# Altium schematic sheet Digital.SchDoc
size 494 x 320 mm
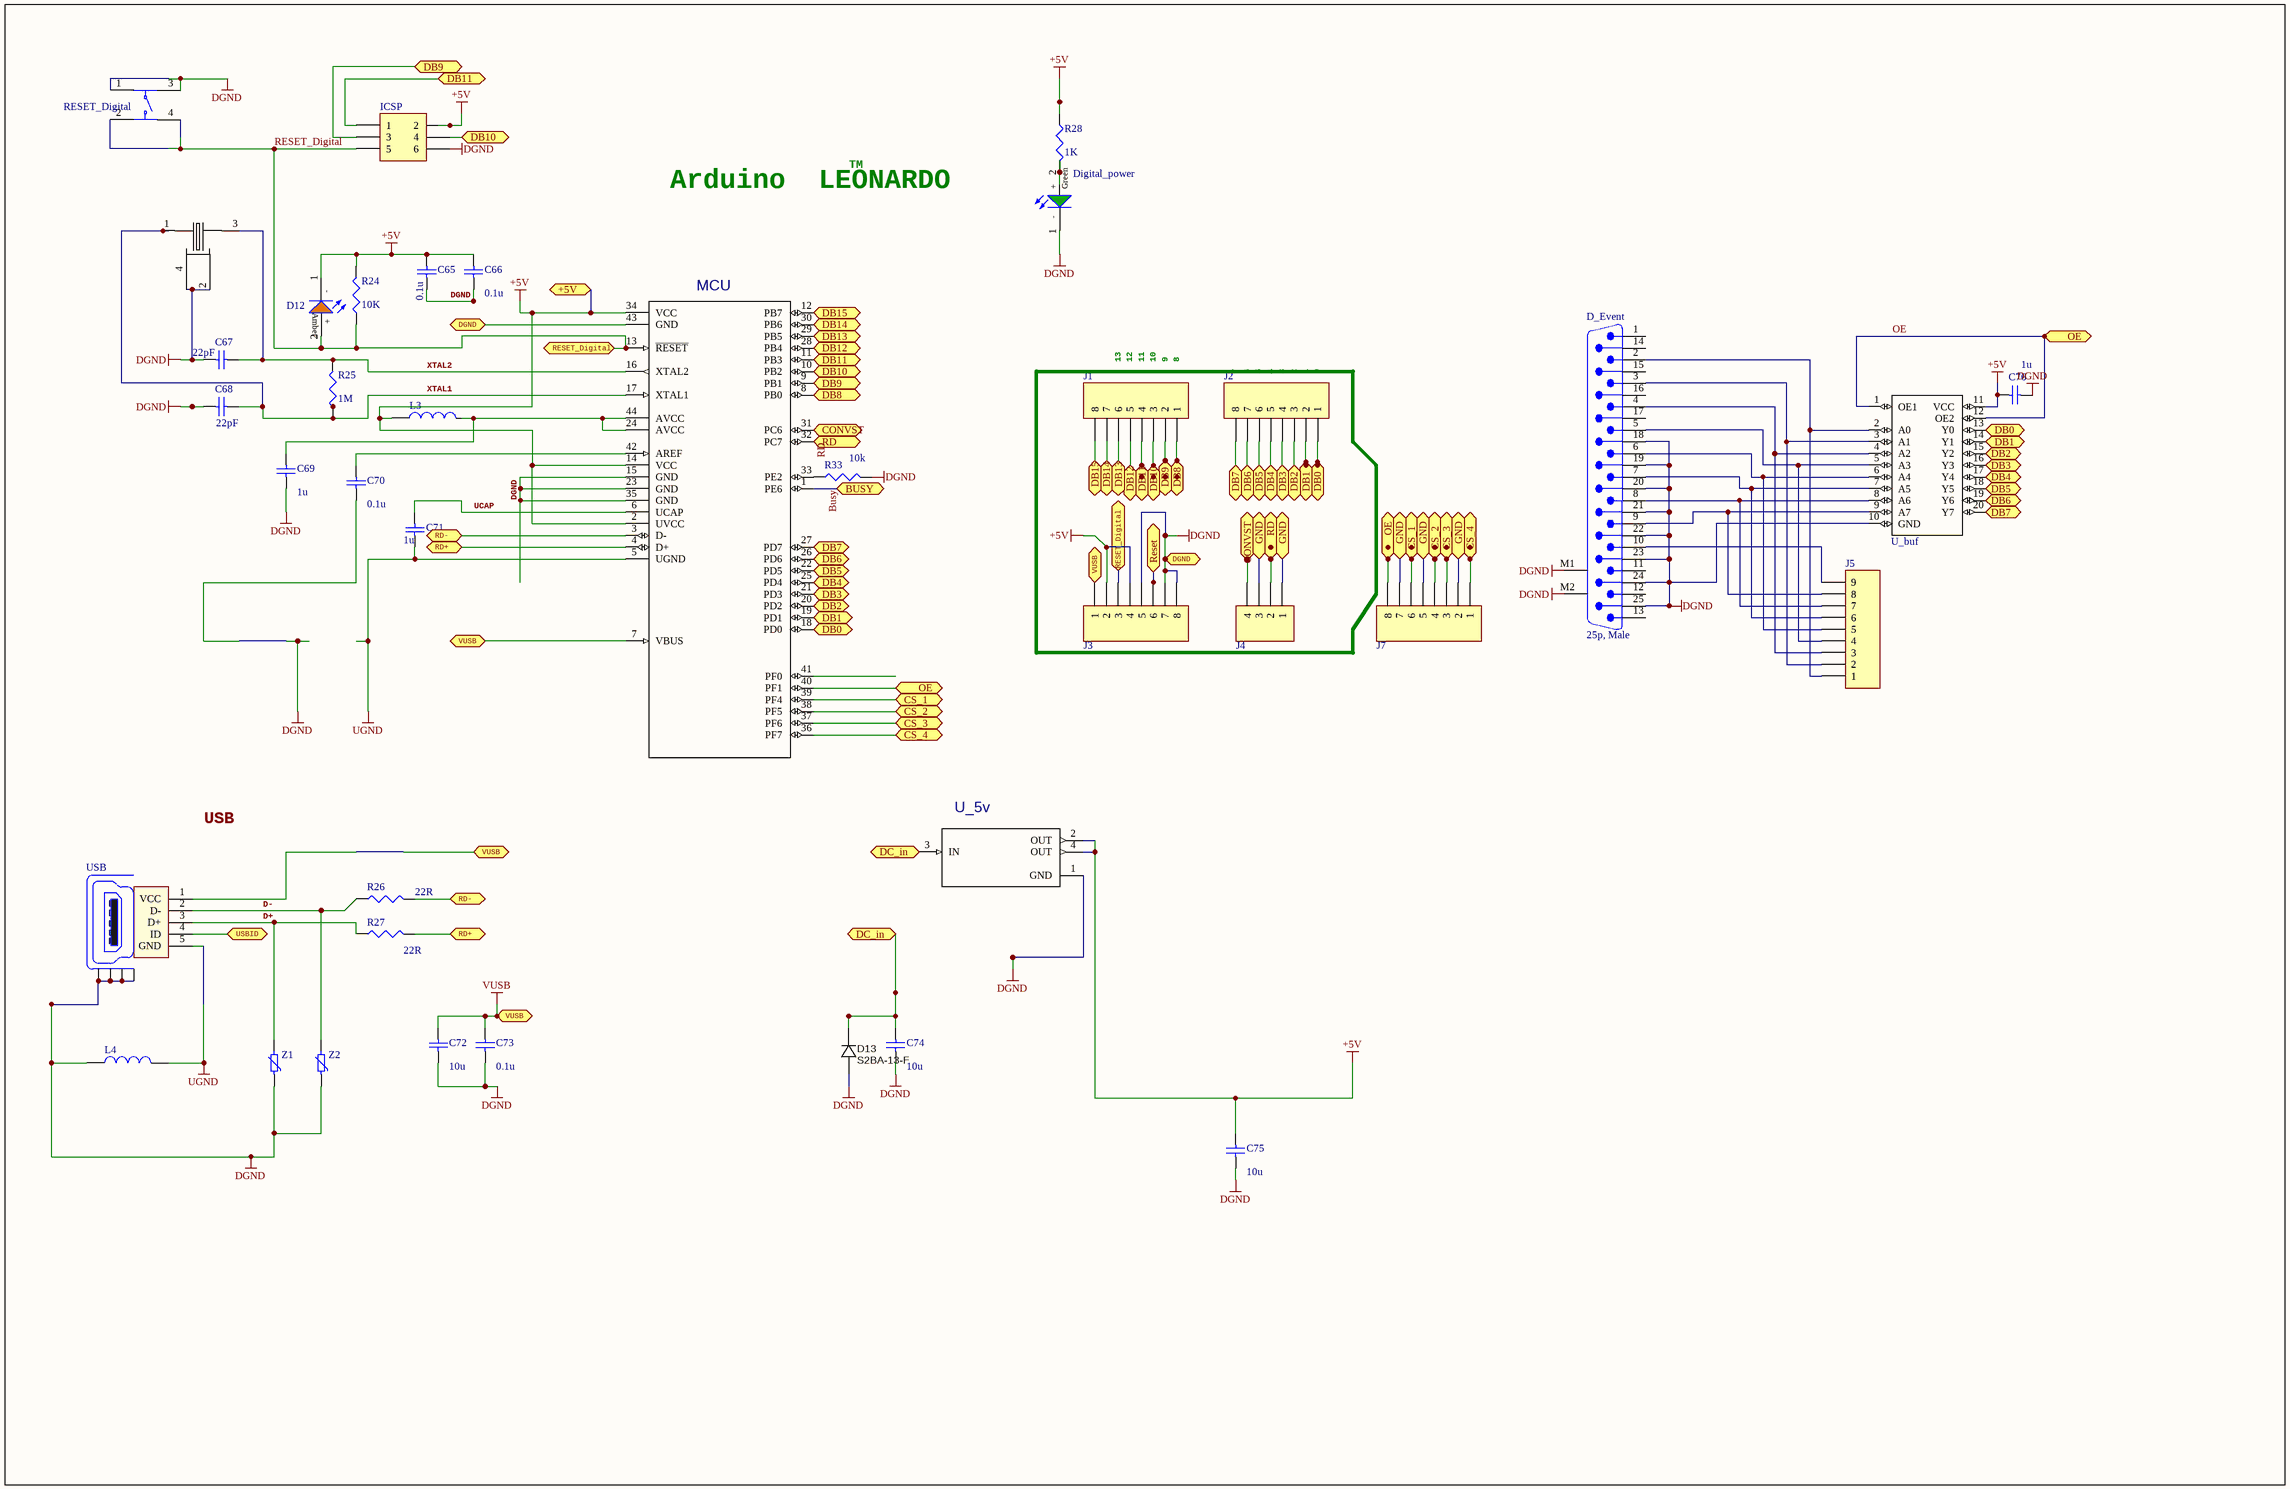
[diagram p0: Digital.SchDoc]

## Parts
C65  value 0.1u  [0603]
C66  value 0.1u  [0603]
C67  value 22pF  [0603]
C68  value 22pF  [0603]
C69  value 1u  [0805]
C70  value 0.1u  [0603]
C71  value 1u  [0805]
C72  value 10u  [0805]
C73  value 0.1u  [0603]
C74  value 10u  [0805]
C75  value 10u  [0805]
C76  value 1u  [0805]
D12  150120AS75000  [WL-SMCW_1206]  (value not drawn)
D13  Manufacturer Part Number 1: S2BA-13-F  [DO-214AC]  (hidden comment: 100V; 1.5A)
D_Event  25p, Male  [618025233721]
Digital_power  150080GS75000  [WL-SMCW_0805]  (value not drawn)
ICSP  (no value)  [HDR2X3]
J1  (no value)  [HDR1X8]
J2  (no value)  [HDR1X8]
J3  (no value)  [HDR1X8]
J4  (no value)  [HDR1X4]
J5  (no value)  [HDR1X9]
J7  (no value)  [HDR1X8]
L3  (no value)  [WE-CBF_0805_High Speed]
L4  (no value)  [WE-CBF_0805_High Speed]
MCU  ATMEGA32U4-AU  [QFP80P1200X1200X120-44N]  (value not drawn)
R24  value 10K  [J1-0603]
R25  value 1M  [J1-0603]
R26  value 22R  [J1-0603]
R27  value 22R  [J1-0603]
R28  value 1K  [J1-0603]
R33  value 10k  [J1-0603]
RESET_Digital  430152043826  [4301x20438x6]  (value not drawn)
U_5v  NCP1117ST50T3G  [SOT230P700X180-4N]  (value not drawn)
U_buf  74HC541  [TSSOP20]  (value not drawn)
USB  651005136521  [651005136521]  (value not drawn)
Y1  ABM3B-24.000MHZ-B2-T  [OSCSC500X320X110-4N]  (value not drawn)
Z1  14 Vrms , 18 Vdc  [WE-VS_0603]  (value not drawn)
Z2  14 Vrms , 18 Vdc  [WE-VS_0603]  (value not drawn)

## Ports
+5V, BUSY, CONVST, CS_1, CS_2, CS_3, CS_4, DB0, DB1, DB2, DB3, DB4, DB5, DB6, DB7, DB8, DB9, DB10, DB11, DB12, DB13, DB14, DB15, DC_in, DGND, GND, OE, RD, RD+, RD-, Reset, RESET_Digital, USBID, VUSB

## Nets
+5V: C65.2 C66.2 C75.1 C76.2 D12.1(-) ICSP.2 J3.2 J3.4 L3.1 MCU.2(UVCC) MCU.14(VCC) MCU.34(VCC) R24.2 R28.1 U_5v.2(OUT) U_5v.4(OUT) U_buf.11(VCC) ; port +5V
DGND: C65.1 C66.1 C67.2 C68.2 C69.1 C70.2 C72.1 C73.1 C74.2 C75.2 C76.1 D13.A D_Event.18 D_Event.19 D_Event.20 D_Event.21 D_Event.22 D_Event.23 D_Event.24 D_Event.25 D_Event.M1 D_Event.M2 Digital_power.1(-) ICSP.6 J3.5 J3.7 J3.8 L4.1 MCU.15(GND) MCU.23(GND) MCU.35(GND) MCU.43(GND) R33.1 RESET_Digital.1 RESET_Digital.3 U_5v.1(GND) U_buf.10(GND) USB.Z1(Shield) USB.Z2(Shield) USB.Z3(Shield) USB.Z4(Shield) Y1.2 Y1.4 Z1.1(I/O1) Z2.1(I/O1) ; port DGND
UGND: C71.1 L4.2 MCU.5(UGND) USB.5(GND)
VUSB: C72.2 C73.2 J3.1 MCU.7(VBUS) USB.1(VCC) ; port VUSB
Busy: MCU.1(PE6) ; port BUSY
CONVST: J4.4 MCU.31(PC6) ; port CONVST
CS_1: J7.6 MCU.39(PF4) ; port CS_1
CS_2: J7.4 MCU.38(PF5) ; port CS_2
CS_3: J7.3 MCU.37(PF6) ; port CS_3
CS_4: J7.1 MCU.36(PF7) ; port CS_4
D+: R27.2 USB.3(D+) Z1.2(I/O1)
D-: R26.2 USB.2(D-) Z2.2(I/O1)
DB0: J2.1 MCU.18(PD0) U_buf.13(Y0) ; port DB0
DB1: J2.2 MCU.19(PD1) U_buf.14(Y1) ; port DB1
DB2: J2.3 MCU.20(PD2) U_buf.15(Y2) ; port DB2
DB3: J2.4 MCU.21(PD3) U_buf.16(Y3) ; port DB3
DB4: J2.5 MCU.25(PD4) U_buf.17(Y4) ; port DB4
DB5: J2.6 MCU.22(PD5) U_buf.18(Y5) ; port DB5
DB6: J2.7 MCU.26(PD6) U_buf.19(Y6) ; port DB6
DB7: J2.8 MCU.27(PD7) U_buf.20(Y7) ; port DB7
DB8: J1.1 MCU.8(PB0) ; port DB8
DB9: ICSP.3 J1.2 MCU.9(PB1) ; port DB9
DB10: ICSP.4 J1.3 MCU.10(PB2) ; port DB10
DB11: ICSP.1 J1.4 MCU.11(PB3) ; port DB11
DB12: J1.5 MCU.28(PB4) ; port DB12
DB13: J1.6 MCU.29(PB5) ; port DB13
DB14: J1.7 MCU.30(PB6) ; port DB14
DB15: J1.8 MCU.12(PB7) ; port DB15
DC_in: C74.1 D13.K U_5v.3(IN) ; port DC_in
GND: J4.1 J4.3 J7.2 J7.5 J7.7 ; port GND
OE: J7.8 MCU.40(PF1) U_buf.1(OE1) U_buf.12(OE2) ; port OE
RD: J4.2 MCU.32(PC7) ; port RD
RD+: MCU.4(D+) R27.1 ; port RD+
RD-: MCU.3(D-) R26.1 ; port RD-
Reset: J3.6 ; port Reset
RESET_Digital: D12.2(+) ICSP.5 J3.3 MCU.13(~{RESET}) R24.1 RESET_Digital.2 RESET_Digital.4 ; port RESET_Digital
UCAP: C71.2 MCU.6(UCAP)
USBID: USB.4(ID) ; port USBID
XTAL1: C68.1 MCU.17(XTAL1) R25.1 Y1.1
XTAL2: C67.1 MCU.16(XTAL2) R25.2 Y1.3
NetC69_2: C69.2 L3.2 MCU.24(AVCC) MCU.44(AVCC)
NetC70_1: C70.1 MCU.42(AREF)
NetD_Event_2: D_Event.2 J5.1 U_buf.2(A0)
NetD_Event_3: D_Event.3 J5.2 U_buf.3(A1)
NetD_Event_4: D_Event.4 J5.3 U_buf.4(A2)
NetD_Event_5: D_Event.5 J5.4 U_buf.5(A3)
NetD_Event_6: D_Event.6 J5.5 U_buf.6(A4)
NetD_Event_7: D_Event.7 J5.6 U_buf.7(A5)
NetD_Event_8: D_Event.8 J5.7 U_buf.8(A6)
NetD_Event_9: D_Event.9 J5.8 U_buf.9(A7)
NetD_Event_10: D_Event.10 J5.9
NetDigital_power_2: Digital_power.2(+) R28.2
NetMCU_33: MCU.33(PE2) R33.2

Not connected (* = marked no-connect by the designer): D_Event 1 11 12 13 14 15 16 17; MCU 41(PF0)

## Notes on the sheet
- Arduino  LEONARDO
- TM
- 13
- 12
- 11
- 10
- 9
- 8
- (near J2) 7
- (near J2) 6
- (near J2) 5
- (near J2) 4
- (near J2) 3
- (near J2) 2
- (near J2) 1
- (near J2) 0
- USB
- (in symbol WL-SMCW 0805, 150080GS75000) Green
- (in symbol WL-SMCW 1206, 150120AS75000) Amber

## Library data of the parts
C65-C68 C70 C73 = C0603: Ceramic Chip Capacitor - Standard; Note: Footprint corresponds to dimensions for bulk cassette packaging. This case size has tightened tolerances.; Published: 17-Jul-2002; LatestRevisionDate: 19-Mar-2004; LatestRevisionNote: Silkscreen size reduced.; DatasheetDocument: Mar-2001; PackageDocument: Mar-2001; PackageReference: 0603; Publisher: Altium Limited; Code_JEITA: 0603; Code_IPC: 1608 [0603]; ComponentLink1Description: Manufacturer Link; ComponentLink1URL: http://www.kemet.com/; ComponentLink2Description: Datasheet; ComponentLink2URL: http://www.kemet.com/kemet/web/homepage/kechome.nsf/vapubfilesname/F3102TA.pdf/$file/F3102TA.pdf
C69 C71 C72 C74-C76 = C0805: Ceramic Chip Capacitor - Standard; Note: Footprint corresponds to dimensions for bulk cassette packaging. This case size has tightened tolerances.; Published: 17-Jul-2002; LatestRevisionDate: 19-Mar-2004; LatestRevisionNote: Silkscreen size reduced.; DatasheetDocument: Mar-2001; PackageDocument: Mar-2001; PackageReference: 0805; Publisher: Altium Limited; Code_JEITA: 0805; Code_IPC: 2012[0805]; ComponentLink1Description: Manufacturer Link; ComponentLink1URL: http://www.kemet.com/; ComponentLink2Description: Datasheet; ComponentLink2URL: http://www.kemet.com/kemet/web/homepage/kechome.nsf/vapubfilesname/F3102TA.pdf/$file/F3102TA.pdf
D12 = WL-SMCW 1206, 150120AS75000: WL-SMCW SMD chip LED top view mono-color waterclear, 1206, Amber; Manufacturer: Wurth Elektronik; PartNo: 150120AS75000; ComponentLink1Description: Manufacturer; ComponentLink1URL: http://www.we-online.de; Created by: Baojun Chen; Created Date: March 2016; ComponentLink2Description: Datasheet; ComponentLink2URL: http://katalog.we-online.de/led/datasheet/150120AS75000.pdf
D13 = DIODE_100V_1.5A_SMA: Diode SMD 100V 1.5A SMA; Manufacturer 1: Diodes Inc; Material: Si; Diode Type: Standard; Value: Vf = 1.15V @ 1.5A (Max); SCDType: source; Package / Case: DO-214AC, SMA; Ratings: 100V; 1.5A; Supplier 1: Digi-Key; Supplier Part Number 1: S2BA-FDICT-ND
D_Event = 618025233721: WR-DSUB 10.30mm Male Angled PCB Connector without Hex Screw, 25p; PinNumber: 25; ComponentLink1URL: http://www.we-online.de; ComponentLink2URL: http://katalog.we-online.de/em/datasheet/6180xx233721.pdf; Published: June 2016; Publisher: Wurth Elektronik; ComponentLink1Description: Manufacturer; ComponentLink2Description: Datasheet; PartNumber: 618025233721
Digital_power = WL-SMCW 0805, 150080GS75000: WL-SMCW SMD chip LED top view mono-color waterclear, 0805, Green; Manufacturer: Wurth Elektronik; PartNo: 150080GS75000; ComponentLink1Description: Manufacturer; ComponentLink1URL: http://www.we-online.de; Created by: Baojun Chen; Created Date: March 2016; ComponentLink2Description: Datasheet; ComponentLink2URL: http://katalog.we-online.de/led/datasheet/150080GS75000.pdf
ICSP = Header 3X2: Header, 3-Pin, Dual row; LatestRevisionDate: 17-Jul-2002; LatestRevisionNote: Re-released for DXP Platform.; Publisher: Altium Limited
J1-J3 J7 = Header 8: Header, 8-Pin; LatestRevisionDate: 17-Jul-2002; LatestRevisionNote: Re-released for DXP Platform.; Publisher: Altium Limited
J4 = Header 4: Header, 4-Pin; LatestRevisionDate: 17-Jul-2002; LatestRevisionNote: Re-released for DXP Platform.; Publisher: Altium Limited
J5 = Header 9: Header, 9-Pin; LatestRevisionDate: 17-Jul-2002; LatestRevisionNote: Re-released for DXP Platform.; Publisher: Altium Limited
L3 L4 = WE-CBF, 7427920: WE-CBF SMD EMI Suppression Ferrite Bead, 0805, 11Ω; Type: High Speed; PublishedDate: Aug 2016; Publisher: Wurth Elektronik; ComponentLink1Description: Manufacturer; ComponentLink1URL: http://www.we-online.de; ComponentLink2Description: Datasheet; ComponentLink2URL: http://katalog.we-online.de/pbs/datasheet/7427920.pdf; PartNumber: 7427920; Value: 11Ω; Size: 0805
MCU = ATMEGA32U4-AU: ATmega Series 16 MHz 32 KB Flash 2.5 KB SRAM 8-Bit Microcontroller - TQFP-44; MF: Atmel; Price: 4.16 USD; Package: TQFP-44 Atmel; Availability: Good; MP: ATMEGA32U4-AU; Value: *
R24-R28 R33 = Res3: Resistor; Published: 8-Jun-2000; LatestRevisionDate: 29-May-2009; LatestRevisionNote: IPC-7351 Footprint Added.; PackageReference: J1-0603; Publisher: Altium Limited; PackageDescription: Chip Resistor
RESET_Digital = WS-TASV, 430152043826: WS-TASV 6x6 mm SMD; Manufacturer: Wurth Elektronik; partNo: 430152043826; ComponentLink1Description: Manufacturer; ComponentLink1URL: http://www.we-online.de; Created by: Baojun Chen; Created Date: Dec.2015; ComponentLink2Description: Datasheet; ComponentLink2URL: http://katalog.we-online.de/em/datasheet/4301x2xxx8x6.pdf
U_5v = NCP1117ST50T3G: 1.0 A Positive LDO Linear Voltage Regulator (Fixed and Adjustable) Vout: 5.0 V; MF: ON Semiconductor; Package: SOT-223-3 ON Semiconductor; MP: NCP1117ST50T3G; Price: 0.23 USD; Availability: Good; Value: *
U_buf = 74HC541: Tri-St.%20Oct%20Buffer%20DIP20; MF: Texas Instruments; Price: None; MP: 74HC541; Package: DIP-20 Texas Instruments; Availability: Unavailable; Value: *
USB = 651005136521: WR-COM Mini USB Horizontal TH Type B 5 Contacts; Manufacturer: Würth Elektronik eiSos GmbH; ComponentLink1 Description: Manufacturer; ComponentLink2 Description: Datasheet; NoPins: 5; ComponentLink1URL: http://www.we-online.de; ComponentLink2URL: http://katalog.we-online.de/em/datasheet/651005136521.pdf; Created by: Karrer Zheng; Created Date: 10/10/2014; partNo: 651005136521
Y1 = ABM3B-24.000MHZ-B2-T: Crystal 24MHz أ‚آ±20ppm (Tol) أ‚آ±50ppm (Stability) 18pF FUND 50Ohm 4-Pin CSMD T/R; MF: Abracon; Availability: Good; MP: ABM3B-24.000MHZ-B2-T; Package: 5.0 x 3.2mm Abracon; Price: 0.65 USD; Value: *
Z1 Z2 = 82556140: WE-VS SMD Varistor, size 0603, 14 Vrms , 18 Vdc; PublishedDate: Nov. 2016; Publisher: Wurth Elektronik; ComponentLink1Description: Manufacturer; ComponentLink1URL: http://www.we-online.de; ComponentLink2Description: Datasheet; ComponentLink2URL: http://katalog.we-online.de/pbs/datasheet/82556140.pdf; PartNumber: 82556140; Size: 0603; Value: 14 Vrms , 18 Vdc